# Altium schematic sheet KillSwitch_MotorOut.SchDoc
size A
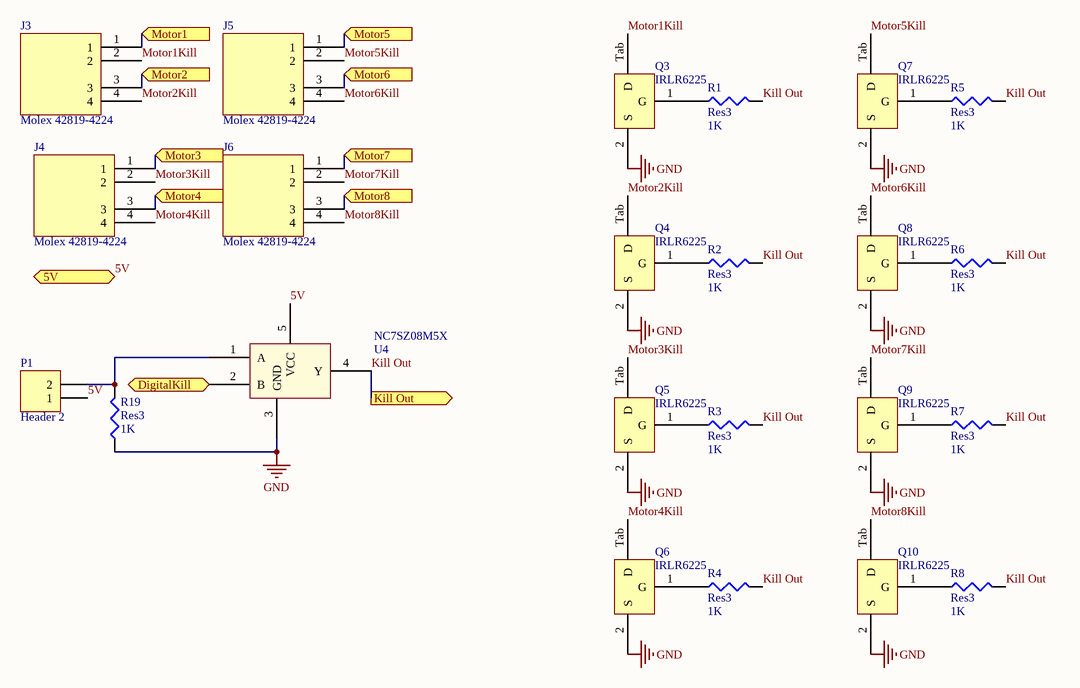
[diagram p0: KillSwitch_MotorOut.SchDoc]

## Parts
J3  Molex 42819-4224  [MOLEX_42819-4224]
J4  Molex 42819-4224  [MOLEX_42819-4224]
J5  Molex 42819-4224  [MOLEX_42819-4224]
J6  Molex 42819-4224  [MOLEX_42819-4224]
NC7SZ08M5X  U4  [NC7SZ08M5X]
P1  Header 2  [HDR1X2]
Q3  IRLR6225  [IRLR6225]
Q4  IRLR6225  [IRLR6225]
Q5  IRLR6225  [IRLR6225]
Q6  IRLR6225  [IRLR6225]
Q7  IRLR6225  [IRLR6225]
Q8  IRLR6225  [IRLR6225]
Q9  IRLR6225  [IRLR6225]
Q10  IRLR6225  [IRLR6225]
R1  Res3  value 1K  [J1-0603]
R2  Res3  value 1K  [J1-0603]
R3  Res3  value 1K  [J1-0603]
R4  Res3  value 1K  [J1-0603]
R5  Res3  value 1K  [J1-0603]
R6  Res3  value 1K  [J1-0603]
R7  Res3  value 1K  [J1-0603]
R8  Res3  value 1K  [J1-0603]
R19  Res3  value 1K  [J1-0603]

## Ports
5V (in), DigitalKill (in), Kill Out (out), Motor1 (in), Motor2 (in), Motor3 (in), Motor4 (in), Motor5 (in), Motor6 (in), Motor7 (in), Motor8 (in)

## Nets
GND: NC7SZ08M5X.3(GND) Q3.2(S) Q4.2(S) Q5.2(S) Q6.2(S) Q7.2(S) Q8.2(S) Q9.2(S) Q10.2(S) R19.1
5V: NC7SZ08M5X.5(VCC) P1.1 ; port 5V
DigitalKill: NC7SZ08M5X.2(B) ; port DigitalKill
Kill Out: NC7SZ08M5X.4(Y) R1.2 R2.2 R3.2 R4.2 R5.2 R6.2 R7.2 R8.2 ; port Kill Out
Motor1: J3.1 ; port Motor1
Motor1Kill: J3.2 Q3.Tab(D)
Motor2: J3.3 ; port Motor2
Motor2Kill: J3.4 Q4.Tab(D)
Motor3: J4.1 ; port Motor3
Motor3Kill: J4.2 Q5.Tab(D)
Motor4: J4.3 ; port Motor4
Motor4Kill: J4.4 Q6.Tab(D)
Motor5: J5.1 ; port Motor5
Motor5Kill: J5.2 Q7.Tab(D)
Motor6: J5.3 ; port Motor6
Motor6Kill: J5.4 Q8.Tab(D)
Motor7: J6.1 ; port Motor7
Motor7Kill: J6.2 Q9.Tab(D)
Motor8: J6.3 ; port Motor8
Motor8Kill: J6.4 Q10.Tab(D)
NetNC7SZ08M5X_1: NC7SZ08M5X.1(A) P1.2 R19.2
NetQ3_1: Q3.1(G) R1.1
NetQ4_1: Q4.1(G) R2.1
NetQ5_1: Q5.1(G) R3.1
NetQ6_1: Q6.1(G) R4.1
NetQ7_1: Q7.1(G) R5.1
NetQ8_1: Q8.1(G) R6.1
NetQ9_1: Q9.1(G) R7.1
NetQ10_1: Q10.1(G) R8.1

## Library data of the parts
J3-J6 = Molex_42819-4224
NC7SZ08M5X = NC7SZ08M5X
P1 = Header 2: Header, 2-Pin; LatestRevisionDate: 17-Jul-2002; LatestRevisionNote: Re-released for DXP Platform.; Publisher: Altium Limited
R1-R8 R19 = Res3: Resistor; Published: 8-Jun-2000; LatestRevisionDate: 29-May-2009; LatestRevisionNote: IPC-7351 Footprint Added.; PackageReference: J1-0603; Publisher: Altium Limited; PackageDescription: Chip Resistor